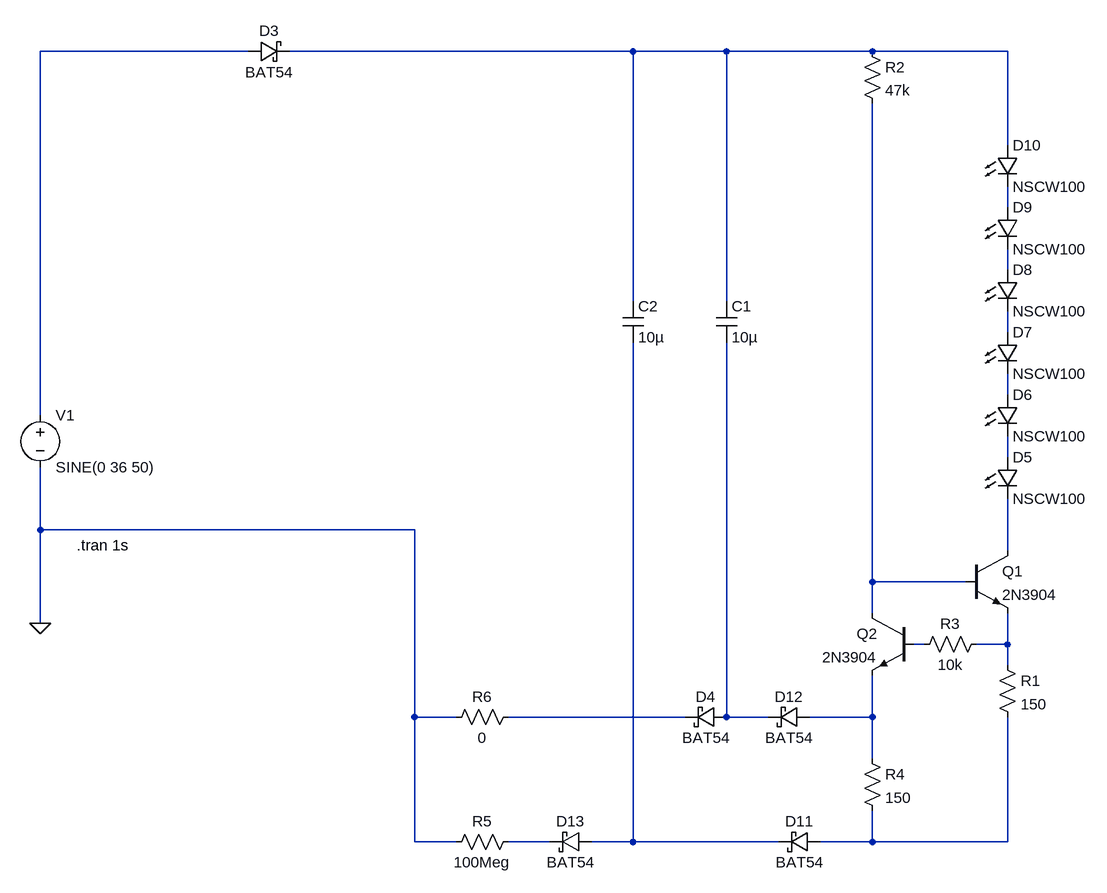
[diagram p0: schematic half_wave_with_dimming.asc]
half_wave_with_dimming.asc, the LTspice schematic file:
Version 4
SHEET 1 880 680
WIRE -1504 -976 -1824 -976
WIRE -912 -976 -1440 -976
WIRE -768 -976 -912 -976
WIRE -544 -976 -768 -976
WIRE -336 -976 -544 -976
WIRE -336 -832 -336 -976
WIRE -336 -736 -336 -768
WIRE -336 -640 -336 -672
WIRE -912 -592 -912 -976
WIRE -768 -592 -768 -976
WIRE -336 -544 -336 -576
WIRE -336 -448 -336 -480
WIRE -1824 -416 -1824 -976
WIRE -336 -352 -336 -384
WIRE -1824 -240 -1824 -336
WIRE -1248 -240 -1824 -240
WIRE -336 -208 -336 -288
WIRE -544 -160 -544 -896
WIRE -400 -160 -544 -160
WIRE -544 -112 -544 -160
WIRE -1824 -96 -1824 -240
WIRE -464 -64 -480 -64
WIRE -336 -64 -336 -112
WIRE -336 -64 -384 -64
WIRE -336 -32 -336 -64
WIRE -1248 48 -1248 -240
WIRE -1184 48 -1248 48
WIRE -832 48 -1104 48
WIRE -768 48 -768 -528
WIRE -704 48 -768 48
WIRE -544 48 -544 -16
WIRE -544 48 -640 48
WIRE -544 112 -544 48
WIRE -1248 240 -1248 48
WIRE -1184 240 -1248 240
WIRE -1040 240 -1104 240
WIRE -912 240 -912 -528
WIRE -912 240 -976 240
WIRE -688 240 -912 240
WIRE -544 240 -544 192
WIRE -544 240 -624 240
WIRE -336 240 -336 48
WIRE -336 240 -544 240
FLAG -1824 -96 0
SYMBOL voltage -1824 -432 R0
WINDOW 123 0 0 Left 0
WINDOW 39 0 0 Left 0
SYMATTR InstName V1
SYMATTR Value SINE(0 36 50)
SYMBOL schottky -1504 -960 R270
WINDOW 0 32 32 VTop 2
WINDOW 3 0 32 VBottom 2
SYMATTR InstName D3
SYMATTR Value BAT54
SYMATTR Description Diode
SYMATTR Type diode
SYMBOL schottky -768 32 R90
WINDOW 0 0 32 VBottom 2
WINDOW 3 32 32 VTop 2
SYMATTR InstName D4
SYMATTR Value BAT54
SYMATTR Description Diode
SYMATTR Type diode
SYMBOL LED -352 -352 R0
SYMATTR InstName D5
SYMATTR Value NSCW100
SYMATTR Description Diode
SYMATTR Type diode
SYMBOL cap -784 -592 R0
SYMATTR InstName C1
SYMATTR Value 10µ
SYMBOL npn -400 -208 R0
SYMATTR InstName Q1
SYMATTR Value 2N3904
SYMBOL res -352 -48 R0
SYMATTR InstName R1
SYMATTR Value 150
SYMBOL res -560 -992 R0
SYMATTR InstName R2
SYMATTR Value 47k
SYMBOL npn -480 -112 M0
SYMATTR InstName Q2
SYMATTR Value 2N3904
SYMBOL res -368 -80 R90
WINDOW 0 0 56 VBottom 2
WINDOW 3 32 56 VTop 2
SYMATTR InstName R3
SYMATTR Value 10k
SYMBOL LED -352 -448 R0
SYMATTR InstName D6
SYMATTR Value NSCW100
SYMATTR Description Diode
SYMATTR Type diode
SYMBOL LED -352 -544 R0
SYMATTR InstName D7
SYMATTR Value NSCW100
SYMATTR Description Diode
SYMATTR Type diode
SYMBOL LED -352 -640 R0
SYMATTR InstName D8
SYMATTR Value NSCW100
SYMATTR Description Diode
SYMATTR Type diode
SYMBOL LED -352 -736 R0
SYMATTR InstName D9
SYMATTR Value NSCW100
SYMATTR Description Diode
SYMATTR Type diode
SYMBOL LED -352 -832 R0
SYMATTR InstName D10
SYMATTR Value NSCW100
SYMATTR Description Diode
SYMATTR Type diode
SYMBOL res -560 96 R0
SYMATTR InstName R4
SYMATTR Value 150
SYMBOL schottky -624 224 R90
WINDOW 0 0 32 VBottom 2
WINDOW 3 32 32 VTop 2
SYMATTR InstName D11
SYMATTR Value BAT54
SYMATTR Description Diode
SYMATTR Type diode
SYMBOL schottky -640 32 R90
WINDOW 0 0 32 VBottom 2
WINDOW 3 32 32 VTop 2
SYMATTR InstName D12
SYMATTR Value BAT54
SYMATTR Description Diode
SYMATTR Type diode
SYMBOL cap -928 -592 R0
SYMATTR InstName C2
SYMATTR Value 10µ
SYMBOL schottky -976 224 R90
WINDOW 0 0 32 VBottom 2
WINDOW 3 32 32 VTop 2
SYMATTR InstName D13
SYMATTR Value BAT54
SYMATTR Description Diode
SYMATTR Type diode
SYMBOL res -1088 224 R90
WINDOW 0 0 56 VBottom 2
WINDOW 3 32 56 VTop 2
SYMATTR InstName R5
SYMATTR Value 100Meg
SYMBOL res -1088 32 R90
WINDOW 0 0 56 VBottom 2
WINDOW 3 32 56 VTop 2
SYMATTR InstName R6
SYMATTR Value 0
TEXT -1768 -216 Left 2 !.tran 1s

The netlist it stands for:
* half_wave_with_dimming.asc
V1 N001 0 SINE(0 36 50)
D3 N001 N002 BAT54
D4 N013 N012 BAT54
D5 N007 N008 NSCW100
C1 N002 N013 10µ
Q1 N008 N009 N011 0 2N3904
R1 N011 N017 150
R2 N002 N009 47k
Q2 N009 N010 N014 0 2N3904
R3 N011 N010 10k
D6 N006 N007 NSCW100
D7 N005 N006 NSCW100
D8 N004 N005 NSCW100
D9 N003 N004 NSCW100
D10 N002 N003 NSCW100
R4 N014 N017 150
D11 N017 N016 BAT54
D12 N014 N013 BAT54
C2 N002 N016 10µ
D13 N016 N015 BAT54
R5 N015 0 100Meg
R6 N012 0 0
.model D D
.lib standard.dio
.model NPN NPN
.model PNP PNP
.lib standard.bjt
.tran 1s
.backanno
.end